# EAGLE design Sine 5KW co sac copy (EAGLE 9.6.2)
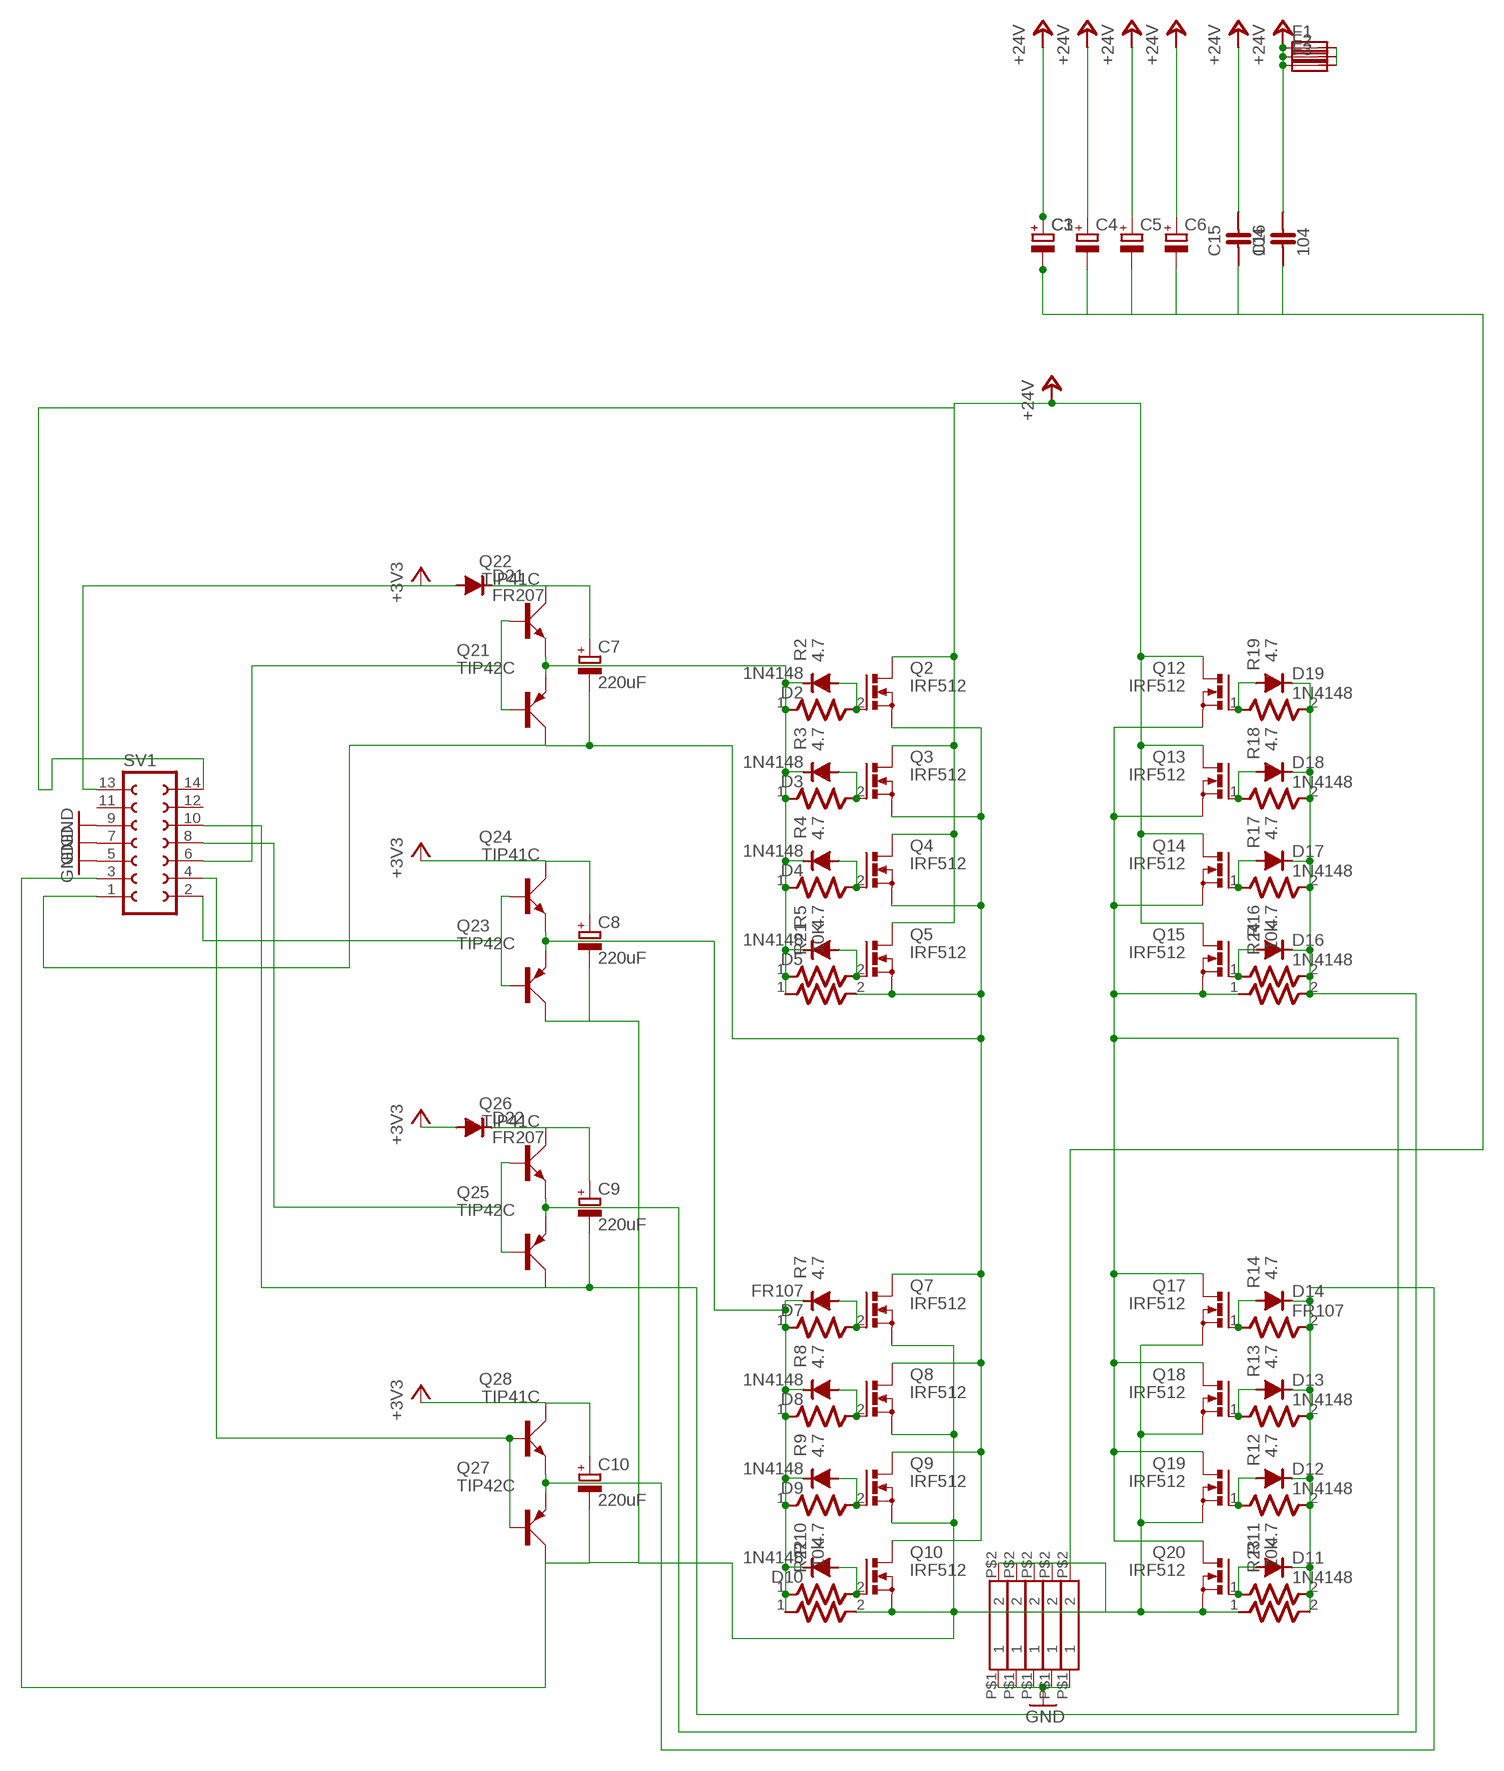
[diagram p0: schematic, sheet 1]

## Parts
C1  CPOL-EUE7.5-18  [E7,5-18]
C3  CPOL-EUE7.5-18  [E7,5-18]
C4  CPOL-EUE7.5-18  [E7,5-18]
C5  CPOL-EUE7.5-18  [E7,5-18]
C6  CPOL-EUE7.5-18  [E7,5-18]
C7  220uF  CPOL-EUE5-8.5  [E5-8,5]
C8  220uF  CPOL-EUE5-8.5  [E5-8,5]
C9  220uF  CPOL-EUE5-8.5  [E5-8,5]
C10  220uF  CPOL-EUE5-8.5  [E5-8,5]
C15  104  CAP-NP5  [CAP-NP5]
C16  104  CAP-NP5  [CAP-NP5]
D2  1N4148  [D-7,5]
D3  1N4148  [D-7,5]
D4  1N4148  [D-7,5]
D5  1N4148  [D-7,5]
D7  FR107  1N4148  [D-7,5]
D8  1N4148  [D-7,5]
D9  1N4148  [D-7,5]
D10  1N4148  [D-7,5]
D11  1N4148  [D-7,5]
D12  1N4148  [D-7,5]
D13  1N4148  [D-7,5]
D14  FR107  1N4148  [D-7,5]
D16  1N4148  [D-7,5]
D17  1N4148  [D-7,5]
D18  1N4148  [D-7,5]
D19  1N4148  [D-7,5]
D21  FR207  1N4148  [D-7,5]
D22  FR207  1N4148  [D-7,5]
F1  LITTLEFUSE  [LITTLEFUSE]
F2  LITTLEFUSE  [LITTLEFUSE]
F3  LITTLEFUSE  [LITTLEFUSE]
Q2  IRF512  [TO220BV]
Q3  IRF512  [TO220BV]
Q4  IRF512  [TO220BV]
Q5  IRF512  [TO220BV]
Q7  IRF512  [TO220BV]
Q8  IRF512  [TO220BV]
Q9  IRF512  [TO220BV]
Q10  IRF512  [TO220BV]
Q12  IRF512  [TO220BV]
Q13  IRF512  [TO220BV]
Q14  IRF512  [TO220BV]
Q15  IRF512  [TO220BV]
Q17  IRF512  [TO220BV]
Q18  IRF512  [TO220BV]
Q19  IRF512  [TO220BV]
Q20  IRF512  [TO220BV]
Q21  TIP42C  [TO220AV]
Q22  TIP41C  [TO220AV]
Q23  TIP42C  [TO220AV]
Q24  TIP41C  [TO220AV]
Q25  TIP42C  [TO220AV]
Q26  TIP41C  [TO220AV]
Q27  TIP42C  [TO220AV]
Q28  TIP41C  [TO220AV]
R2  4.7  R-7,5  [R-7,5]
R3  4.7  R-7,5  [R-7,5]
R4  4.7  R-7,5  [R-7,5]
R5  4.7  R-7,5  [R-7,5]
R7  4.7  R-7,5  [R-7,5]
R8  4.7  R-7,5  [R-7,5]
R9  4.7  R-7,5  [R-7,5]
R10  4.7  R-7,5  [R-7,5]
R11  4.7  R-7,5  [R-7,5]
R12  4.7  R-7,5  [R-7,5]
R13  4.7  R-7,5  [R-7,5]
R14  4.7  R-7,5  [R-7,5]
R16  4.7  R-7,5  [R-7,5]
R17  4.7  R-7,5  [R-7,5]
R18  4.7  R-7,5  [R-7,5]
R19  4.7  R-7,5  [R-7,5]
R21  10K  R-7,5  [R-7,5]
R22  10k  R-7,5  [R-7,5]
R23  10k  R-7,5  [R-7,5]
R24  10k  R-7,5  [R-7,5]
SV1  FE07-2  [FE07-2]
U$2  SHUNT  [SHUNT]
U$3  SHUNT  [SHUNT]
U$8  SHUNT  [SHUNT]
U$9  SHUNT  [SHUNT]
U$10  SHUNT  [SHUNT]

## Nets
+3V3: C8.+ C10.+ D21.A D22.A Q24.C Q28.C SV1.13
GND: SV1.5 SV1.7 SV1.9 U$2.P$1 U$3.P$1 U$8.P$1 U$9.P$1 U$10.P$1
N$1: Q23.B Q24.B SV1.2
N$2: C9.+ D22.C Q26.C
N$3: Q21.B Q22.B SV1.6
N$4: D7.C D8.C D9.C D10.C Q23.E Q24.E R7.1 R8.1 R9.1 R10.1 R22.1
N$5: D13.A Q18.G R13.1
N$6: Q27.B Q28.B SV1.4
N$7: D2.A Q2.G R2.2
N$8: D3.A Q3.G R3.2
N$9: D4.A Q4.G R4.2
N$10: D5.A Q5.G R5.2
N$11: F1.2 F2.2 F3.2
N$12: D7.A Q7.G R7.2
N$13: D8.A Q8.G R8.2
N$14: D9.A Q9.G R9.2
N$15: D10.A Q10.G R10.2
N$16: D11.A Q20.G R11.1
N$17: D12.A Q19.G R12.1
N$18: C9.- Q12.S Q13.S Q14.S Q15.S Q17.D Q18.D Q19.D Q20.D Q25.C R24.1 SV1.10
N$19: D16.A Q15.G R16.1
N$20: D17.A Q14.G R17.1
N$21: D18.A Q13.G R18.1
N$22: D19.A Q12.G R19.1
N$23: Q25.B Q26.B SV1.8
N$24: D14.A Q17.G R14.1
N$25: C1.- C3.- C4.- C5.- C6.- C8.- C10.- C15.1 C16.1 Q7.S Q8.S Q9.S Q10.S Q17.S Q18.S Q19.S Q20.S Q23.C Q27.C R22.2 R23.1 SV1.3 U$2.P$2 U$3.P$2 U$8.P$2 U$9.P$2 U$10.P$2
N$28: D11.C D12.C D13.C D14.C Q27.E Q28.E R11.2 R12.2 R13.2 R14.2 R23.2
N$29: D16.C D17.C D18.C D19.C Q25.E Q26.E R16.2 R17.2 R18.2 R19.2 R24.2
N$35: C7.- Q2.S Q3.S Q4.S Q5.S Q7.D Q8.D Q9.D Q10.D Q21.C R21.2 SV1.1
N$36: C7.+ D21.C Q22.C
N$68: D2.C D3.C D4.C D5.C Q21.E Q22.E R2.1 R3.1 R4.1 R5.1 R21.1
VCC: C1.+ C3.+ C4.+ C5.+ C6.+ C15.2 C16.2 F1.1 F2.1 F3.1 Q2.D Q3.D Q4.D Q5.D Q12.D Q13.D Q14.D Q15.D SV1.14 ; supply symbol labelled +24V
Unconnected: SV1.11 SV1.12

## Library data of the parts
C1 C3-C10 = LBR inverter true sine:CPOL-EU: POLARIZED CAPACITOR, European symbol
C15 C16 = lbr:CAP-NP5
D2-D5 D7-D14 D16-D19 D21 D22 = 4148:1N4148
F1-F3 = LBR inverter true sine:LITTLEFUSE: LITTLEFUSE Picofuse/slow Littlefuse; OC_FARNELL: unknown; OC_NEWARK: unknown
Q2-Q5 Q7-Q10 Q12 Q13 Q15 Q17-Q20 = transistor-power:IRF512: N-CHANNEL MOS FET
Q14 = transistor-power:IRF512: N-CHANNEL MOS FET; SPICEPREFIX: M
Q21 = transistor-power:TIP42C: PNP TRANSISTOR; SPICEPREFIX: Q
Q22 Q24 Q26 Q28 = transistor-power:TIP41C: NPN TRANSISTOR
Q23 Q25 Q27 = transistor-power:TIP42C: PNP TRANSISTOR
R2-R5 R7-R14 R16-R19 R21-R24 = chuong:R-7,5
SV1 = con-lsta:FE07-2: FEMALE HEADER; OC_FARNELL: unknown; OC_NEWARK: unknown; SPICEPREFIX: X
U$2 U$3 U$8-U$10 = LBR inverter true sine:SHUNT

## Board
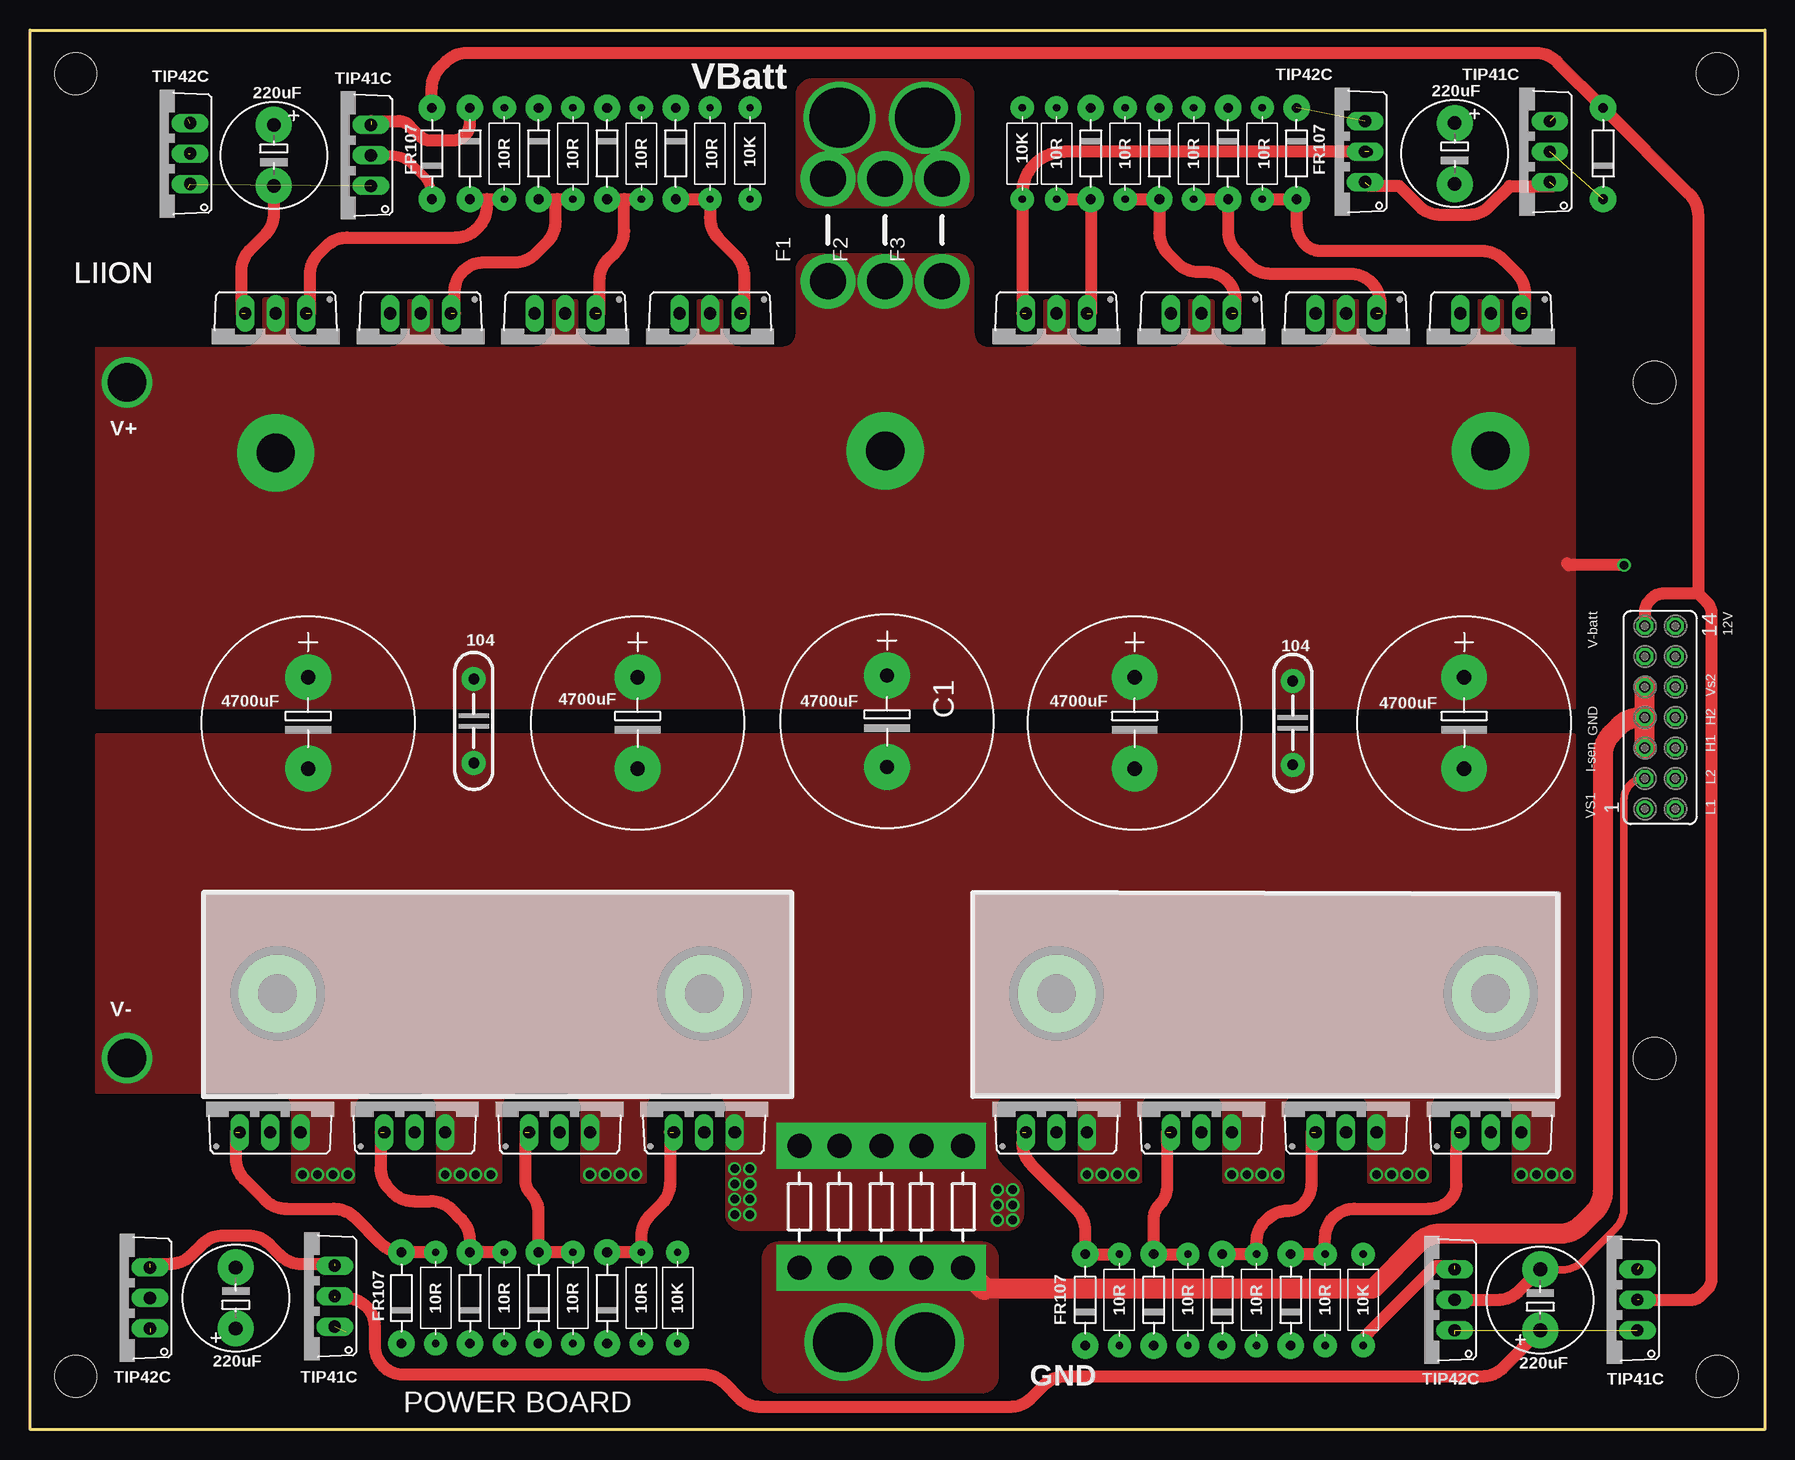
[diagram p1: board, top side]
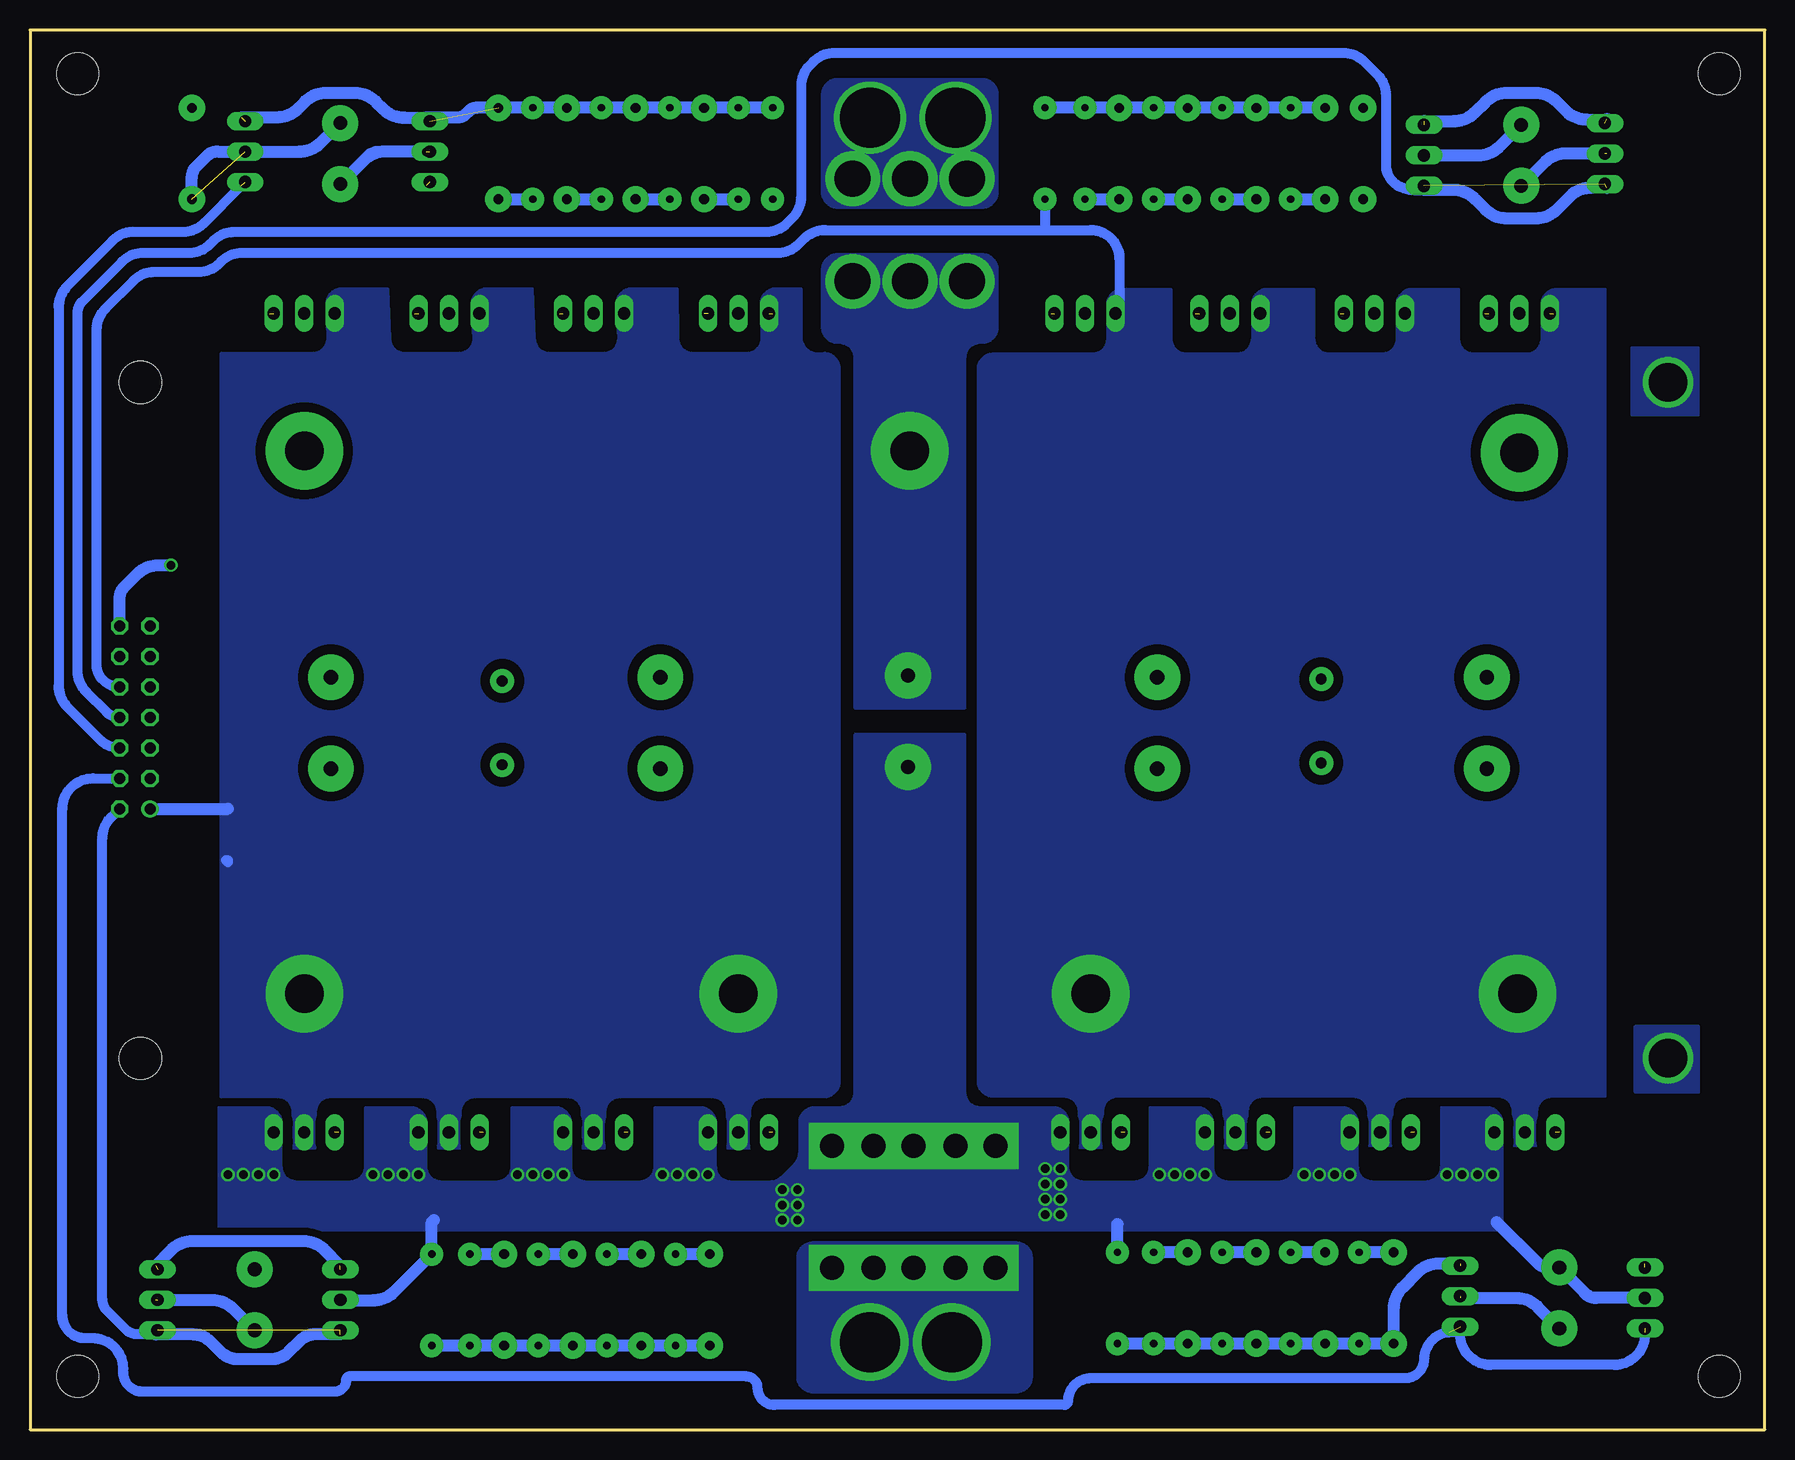
[diagram p2: board, bottom side, seen from below]

Size 144.62 x 116.68 mm. Coordinates in mm from the lower left corner, seen from the top.
Outline: 0,116.68 144.62,116.68 144.62,0 0,0 0,116.68
Copper layers (1*16): Top 0.035mm / dielectric 1.5mm / Bottom 0.035mm
Design rules "default": minimum track width 10mil, minimum drill 24mil, track to track 8mil, track to pad 8mil, pad to pad 8mil, via to via 8mil, smd to smd 8mil, copper to edge 40mil, drill to drill 8mil, minimum pad ring 10mil, minimum via ring 8mil, stop-mask expansion 4mil, vias tented up to drill 0mil, thermal gap 10mil
Holes 3.5 mm at 135.41,87.31 135.41,30.96 3.81,4.45 140.65,4.45 140.65,113.03 3.81,113.03

### Footprints (pad centres in the part's own frame; a part is rotated, then mirrored left to right if it is on the bottom)
E7,5-18 = drill 1.2 pad 3.81: + -3.81,0; - 3.81,0
E5-8,5 = drill 1.15 pad 3: + -2.54,0; - 2.54,0
CAP-NP5 = drill 0.9 pad 2: 1 -3.175,0; 2 3.81,0
D-7,5 = drill 0.8 pad 2.2: A 3.81,0; C -3.81,0
LITTLEFUSE = drill 3 pad 4.572: 1 -5.08,0; 2 3.493,0
TO220BV = drill 1.016 long: D 0,-2.54; G -2.54,-2.54; S 2.54,-2.54
TO220AV = drill 1.016 long: B -2.54,-2.54; C 0,-2.54; E 2.54,-2.54
R-7,5 = drill 0.61 pad 1.93: 1 -3.81,0; 2 3.81,0
FE07-2 = drill 0.914: 1 -7.62,1.27 | drill 0.914 octagon: 2 -7.62,-1.27; 3 -5.08,1.27; 4 -5.08,-1.27; 5 -2.54,1.27; 6 -2.54,-1.27; 7 0,1.27; 8 0,-1.27; 9 2.54,1.27; 10 2.54,-1.27; 11 5.08,1.27; 12 5.08,-1.27; 13 7.62,1.27; 14 7.62,-1.27
SHUNT = drill 2 pad 3.81 square: P$1 -5.08,0; P$2 5.08,0

### Placement (x,y rotation side)
C1  71.44,59.05 270 top
C3  23.18,58.92 270 top
C4  50.65,58.92 270 top
C5  92.08,58.92 270 top
C6  119.55,58.92 270 top
C7  118.75,106.39 270 top
C8  17.15,10.98 90 top
C9  20.33,106.23 270 top
C10  125.9,10.82 90 top
C15  37,58.76 90 top
C16  105.26,58.6 90 top
D2  88.43,106.39 270 top
D3  94.15,106.39 270 top
D4  99.86,106.39 270 top
D5  105.58,106.39 270 top
D7  87.95,10.82 90 top
D8  93.67,10.82 90 top
D9  99.38,10.82 90 top
D10  105.1,10.82 90 top
D11  48.11,10.98 90 top
D12  42.39,10.98 90 top
D13  36.68,10.98 90 top
D14  30.96,10.98 90 top
D16  53.82,106.39 270 top
D17  48.11,106.39 270 top
D18  42.39,106.39 270 top
D19  36.68,106.39 270 top
D21  131.13,106.39 90 top
D22  33.5,106.39 90 top
F1  66.52,100.81 90 top
F2  71.28,100.81 90 top
F3  76.04,100.81 90 top
Q2  85.57,90.51 180 top
Q3  97.64,90.51 180 top
Q4  109.7,90.51 180 top
Q5  121.77,90.51 180 top
Q7  85.57,27.33 0 top
Q8  97.64,27.33 0 top
Q9  109.7,27.33 0 top
Q10  121.77,27.33 0 top
Q12  20.49,90.51 180 top
Q13  32.55,90.51 180 top
Q14  44.62,90.51 180 top
Q15  56.68,90.51 180 top
Q17  20.01,27.33 0 top
Q18  32.07,27.33 0 top
Q19  44.14,27.33 0 top
Q20  56.2,27.33 0 top
Q21  108.75,106.55 90 top
Q22  124.15,106.55 90 top
Q23  116.21,10.82 90 top
Q24  131.45,10.82 90 top
Q25  10.8,106.39 90 top
Q26  25.88,106.23 90 top
Q27  7.47,10.98 90 top
Q28  22.87,11.14 90 top
R2  85.57,106.39 270 top
R3  91.29,106.39 270 top
R4  97,106.39 270 top
R5  102.72,106.39 270 top
R7  90.81,10.82 90 top
R8  96.53,10.82 90 top
R9  102.24,10.82 90 top
R10  107.96,10.82 90 top
R11  50.97,10.98 270 top
R12  45.25,10.98 270 top
R13  39.54,10.98 270 top
R14  33.82,10.98 270 top
R16  56.68,106.39 90 top
R17  50.97,106.39 90 top
R18  45.25,106.39 90 top
R19  39.54,106.39 90 top
R21  82.72,106.39 270 top
R22  111.13,10.82 90 top
R23  53.98,10.98 270 top
R24  60.01,106.39 90 top
SV1  135.89,59.37 90 top
U$2  64.13,18.57 90 top
U$3  67.47,18.57 90 top
U$8  70.96,18.57 90 top
U$9  74.3,18.57 90 top
U$10  77.79,18.57 90 top

### Tracks (layer width: path | path; a pad name or v marks a point on that pad's centre or on a via)
+3V3  (4 unrouted)
  Top 0.254: 52.07,4.6 51.99,4.6
  Top 1.016: 25.41,10.98 26.33,10.98 arc-90 28.73,8.57 28.73,6.98 arc90 31.11,4.6 51.99,4.6 | C10.+ 122.79,5.18 arc-45 121.02,4.44 86.28,4.44 arc45 84.52,3.71 83.44,2.64 arc-45 81.67,1.9 60.88,1.9 arc-45 59.12,2.64 57.88,3.87 arc45 56.11,4.6 52.07,4.6 | D22.A 33.5,111.84 arc-45 34.23,113.6 34.67,114.04 arc-45 36.44,114.78 125.52,114.78 arc-45 127.29,114.04 D21.A | D21.A 131.1,110.2 | D21.A 138.33,103 arc-45 139.06,101.23 139.06,69.69 | 134.15,10.82 138.41,10.82 arc45 139.3,11.19 139.8,11.69 arc45 140.18,12.59 140.18,68.05 arc45 139.8,68.95 139.06,69.69 | 139.06,69.69 136.1,69.69 arc45 135.2,69.32 134.99,69.11 arc45 134.62,68.21 SV1.13
  Bottom 1.016: 25.41,10.98 20.73,10.98 arc45 18.96,10.25 C8.+ | 134.15,10.82 129.47,10.82 arc45 127.7,10.09 C10.+
GND  (via drill 5 pad 6.45)
  Top 1.676: 79.53,11.75 111.92,11.75 115.79,15.62 arc-45 117.56,16.35 127.55,16.35 arc45 129.32,17.08 130.4,18.16 arc45 131.13,19.93 131.13,56.27 arc-45 131.86,58.04 132.46,58.64 arc-45 134.23,59.37 | SV1.9 SV1.7 SV1.5
  Top 1.93: 79.53,11.75 U$10.P$1 | SV1.7 134.23,59.37
  Bottom 1.93: U$10.P$1 arc-45 78.33,13.27
  other vias: 67.79,7.3 74.61,7.3
  pour Bottom (isolate 0.406, no thermals): 61.12,4.45 61.12,14.29 arc-90 62.39,15.56 79.38,15.56 arc-90 80.64,14.29 80.64,4.45 arc-90 79.38,3.17 62.39,3.17 arc-90
  pour Top (isolate 0.406, no thermals): 80.64,4.45 80.64,14.29 arc90 79.38,15.56 62.39,15.56 arc90 61.12,14.29 61.12,4.45 arc90 62.39,3.17 79.38,3.17 arc90
N$1  (2 unrouted)
  Bottom 0.813: SV1.2 137.86,51.06 arc-45 138.59,49.29 138.59,10.84 arc-45 138.22,9.95 136.61,8.33 arc-45 135.71,7.96 134.15,7.96
  Bottom 1.016: 118.75,7.96 120.75,7.96 arc-45 122.16,7.38 123.08,6.46 arc45 124.49,5.87 127.28,5.87 arc45 128.7,6.46 129.59,7.35 arc-45 131,7.94 134.12,7.94 134.15,7.96
N$2
  Top 0.813: Q26.C 30.05,106.23 arc-45 31.82,105.5 32.77,104.55 arc-45 33.5,102.78 D22.C
  Bottom 1.016: Q26.C 23.9,106.23 arc-45 22.13,106.96 C9.+
N$3  (3 unrouted)
  Top 1.016: 111.61,103.69 114.12,103.69 115.79,102.01 arc45 117.56,101.28 119.93,101.28 arc45 121.7,102.01 123.35,103.66 126.98,103.66 127.01,103.69
  Bottom 0.813: SV1.6 arc45 138.79,57.51 141.51,60.23 arc45 142.24,62 142.24,93.58 arc45 141.51,95.35 137.73,99.12 arc45 135.97,99.85 131.88,99.85 arc-45 130.11,100.59 127.01,103.69
N$4  (3 unrouted)
  Top 1.016: R22.1 arc-45 111.57,8.06 117.16,13.65 118.73,13.65 118.75,13.68
  Bottom 1.016: D7.C R7.1 D8.C R8.1 D9.C R9.1 D10.C R10.1 R22.1 | 118.75,13.68 118.77,13.68 120.08,14.98 arc-45 121.84,15.72 131.08,15.72 arc-45 132.84,14.98 134.15,13.68
N$5  (1 unrouted)
  Top 1.016: R13.1 36.7,14.79 36.67,14.76 | 29.22,24.79 29.22,21.83 arc45 29.95,20.06 30.22,19.78 arc45 31.99,19.05 33.41,19.05 arc-45 35.18,18.32 35.95,17.55 arc-45 36.68,15.79 D13.A
  Bottom 1.016: D13.A R13.1
N$6  (2 unrouted)
  Bottom 0.813: 10.01,8.12 10.01,7.94 arc90 12.55,5.4 22.87,5.4 arc90 25.41,7.94 25.41,8.12 26.17,8.12 | 26.17,8.12 26.35,8.12 | SV1.4 139.38,54.29 arc-90 141.92,51.75 141.92,9.52 arc-90 140.02,7.62 139.38,7.62 arc90 136.84,5.08 136.84,4.76 arc-90 135.25,3.17 119.22,3.17 arc-90 118.27,4.13 arc90 117.95,4.44 84.93,4.44 arc90 83.98,3.49 arc-90 82.55,2.06 58.42,2.06 arc-90 58.1,2.38 arc90 56.2,4.29 30,4.29 arc-90 28.42,5.87 arc90 26.17,8.12
N$7  (1 unrouted)
  Top 1.016: 88.43,93.05 D2.A R2.2
N$8  (1 unrouted)
  Top 1.016: 100.49,93.05 100.49,93.06 100.49,94.11 arc45 99.79,95.79 arc45 98.02,96.52 97.4,96.52 arc-45 95.63,97.25 94.88,98 arc-45 94.14,99.77 D3.A R3.2
N$9  (1 unrouted)
  Top 1.016: 112.56,93.05 112.55,93.06 112.55,93.86 arc90 110.05,96.36 103.43,96.36 arc-45 101.66,97.09 100.59,98.16 arc-45 99.86,99.93 D4.A R4.2
N$10  (1 unrouted)
  Top 1.016: 124.62,93.05 124.62,93.06 124.62,94.69 arc45 123.89,96.46 122.81,97.53 arc45 121.04,98.27 107.59,98.27 arc-45 106.31,98.8 arc-45 105.57,100.57 D5.A R5.2
N$11  (via drill 5)
  other vias: 67.47,109.38 74.61,109.38
  pour Top (no thermals): 78.58,111.28 78.58,103.19 arc-90 77.31,101.92 65.25,101.92 arc-90 63.98,103.19 63.98,111.28 arc-90 65.25,112.55 77.31,112.55 arc-90
  pour Bottom (no thermals): 77.31,101.92 65.25,101.92 arc-90 63.98,103.19 63.98,111.28 arc-90 65.25,112.55 77.31,112.55 arc-90 78.58,111.28 78.58,103.19 arc-90
N$12  (1 unrouted)
  Top 1.016: 90.8,14.6 90.78,14.63 D7.A 87.95,16.59 arc45 87.21,18.35 83.45,22.12 arc-45 82.71,23.89 82.71,24.79
  Bottom 1.016: D7.A R7.2
N$13  (1 unrouted)
  Top 1.016: 96.52,14.6 96.49,14.63 D8.A 93.67,17.6 arc-45 94.14,18.73 arc45 94.78,20.28 94.78,24.79
  Bottom 1.016: D8.A R8.2
N$14  (1 unrouted)
  Top 1.016: 99.38,14.6 99.4,14.63 R9.2 102.24,15.64 arc-45 102.97,17.41 103.09,17.52 arc-45 104.86,18.26 arc45 106.07,18.76 106.11,18.79 arc45 106.84,20.56 106.84,24.78 106.84,24.79
  Bottom 1.016: D9.A R9.2
N$15  (1 unrouted)
  Top 1.016: 105.09,14.6 105.12,14.63 R10.2 107.96,15.96 arc-45 108.69,17.72 arc-45 110.35,18.41 116.6,18.41 arc45 118.37,19.15 arc45 118.9,20.45 118.9,23.42 118.91,23.43 118.91,24.79
  Bottom 1.016: D10.A R10.2
N$16  (1 unrouted)
  Top 1.016: 48.1,14.76 48.13,14.79 R11.1 50.97,16.12 arc-45 51.7,17.88 52.61,18.8 arc45 53.35,20.57 53.35,24.79
  Bottom 1.016: D11.A R11.1
N$17  (1 unrouted)
  Top 1.016: R12.1 42.41,14.79 42.39,14.76 | 41.28,24.79 41.28,20.82 arc45 41.75,19.68 arc-45 42.39,18.14 D12.A
  Bottom 1.016: D12.A R12.1
N$18  (via drill 3.2 pad 6.45)  (2 unrouted)
  Top 1.016: C9.- 20.33,101.37 arc-45 19.59,99.6 18.36,98.37 arc45 17.63,96.6 17.63,93.05
  Bottom 0.813: SV1.10 arc45 138.52,62.47 138.59,62.55 arc45 139.06,63.7 139.06,91.67 arc45 138.33,93.44 135.99,95.79 arc45 134.22,96.52 130.58,96.52 arc-45 128.81,97.25 128.69,97.38 arc45 126.92,98.11 82.32,98.11 arc-45 80.55,98.84 80.11,99.28 arc45 78.34,100.01 60.01,100.01 | 60.01,100.01 56.2,100.01 arc90 53.82,97.63 53.82,93.06 arc90 53.82,93.05 | 60.01,102.56 R24.1 60.01,100.02 arc-90 60.01,100.01
  Bottom 1.016: 13.18,106.39 16.59,106.39 arc-45 18.36,105.66 C9.-
  other vias: 20.64,36.35 56.2,36.35
  pour Bottom (isolate 0.813, no thermals): 18.57,90.96 18.57,93.82 arc90 17.3,95.09 13.34,95.09 13.34,27.78 17.78,27.78 arc-90 19.05,26.51 19.05,23.65 20.95,23.65 20.95,26.51 arc-90 22.22,27.78 29.84,27.78 arc-90 31.11,26.51 31.11,23.65 33.02,23.65 33.02,26.51 arc-90 34.29,27.78 41.91,27.78 arc-90 43.18,26.51 43.18,23.5 45.09,23.5 45.09,26.51 arc-90 46.36,27.78 53.98,27.78 arc-90 55.25,26.51 55.25,23.5 57.15,23.5 57.15,26.51 arc-90 58.42,27.78 64.29,27.78 arc90 65.56,29.05 65.56,88.42 arc90 64.29,89.69 56.04,89.69 arc-90 54.77,90.96 54.77,93.82 arc90 53.5,95.09 49.53,95.09 49.53,90.96 arc-90 48.26,89.69 43.97,89.69 arc-90 42.7,90.96 42.7,93.82 arc90 41.43,95.09 37.62,95.09 37.62,90.96 arc-90 36.35,89.69 31.91,89.69 arc-90 30.64,90.96 30.64,93.82 arc90 29.37,95.09 25.56,95.09 25.56,90.96 arc-90 24.29,89.69 19.84,89.69 arc-90
N$19  (1 unrouted)
  Top 1.016: D16.A R16.1 56.68,101.04 arc45 57.41,99.27 58.8,97.89 arc-45 59.53,96.12 59.53,93.06 59.54,93.05
N$20  (1 unrouted)
  Top 1.016: D17.A 49.53,102.58 | 49.53,102.58 R17.1 | 47.47,93.05 47.47,95.81 arc-45 48.21,97.58 48.8,98.17 arc45 49.53,99.94 49.53,102.58
N$21  (1 unrouted)
  Top 1.016: D18.A 43.97,102.58 | 43.97,102.58 R18.1 | 35.41,93.05 35.41,94.92 arc-45 36.1,96.58 arc-45 37.87,97.31 40.4,97.31 arc45 42.17,98.05 43.08,98.96 arc45 43.82,100.73 43.82,102.42 43.97,102.58
N$22  (1 unrouted)
  Top 1.016: D19.A 38.1,102.58 | 38.1,102.58 R19.1 | 23.34,93.05 23.34,96.28 arc-45 24.07,98.05 24.67,98.65 arc-45 26.44,99.38 35.48,99.38 arc45 37.25,100.11 37.37,100.23 arc45 38.1,102 38.1,102.58
N$23  (2 unrouted)
  Bottom 0.813: SV1.8 arc45 138.24,59.82 139.92,61.5 arc45 140.65,63.27 140.65,93.14 arc45 140.28,94.03 136.94,97.38 arc45 135.17,98.11 131.37,98.11 arc-45 129.6,98.84 129.32,99.12 arc45 127.55,99.85 83.27,99.85 arc-45 81.5,100.59 81.06,101.03 arc-45 80.33,102.79 80.33,111.99 arc45 79.59,113.76 79.31,114.04 arc45 77.55,114.78 35.17,114.78 arc45 33.4,114.04 32.32,112.97 arc45 31.59,111.2 31.59,105.38 arc-45 31.05,104.08 arc-45 29.29,103.35 28.45,103.35 28.42,103.37
  Bottom 1.016: 13.18,103.53 14.5,103.53 arc-45 16.26,102.8 17.36,101.7 arc45 19.13,100.96 21.51,100.96 arc45 23.27,101.7 24.19,102.61 arc-45 25.96,103.35 28.4,103.35 28.42,103.37
N$24  (1 unrouted)
  Top 1.016: R14.1 30.98,14.79 30.96,14.76 | 17.15,24.79 17.15,22.62 arc45 17.88,20.85 19.59,19.15 arc45 21.36,18.41 25.32,18.41 arc-45 27.08,17.68 29.28,15.48 arc45 D14.A
  Bottom 1.016: D14.A R14.1
N$25  (via drill 0.7, 3.2)
  Top 0.61: SV1.3 arc90 132.87,52.55 132.87,18.5 arc-45 132.14,16.73 129.48,14.07 arc-45 127.71,13.33 125.92,13.33 C10.-
  Top 1.016: Q23.C 122.32,10.82 arc45 124.09,11.55 C10.- 124.06,11.53 arc-45 122.29,10.79 v118.74,10.79
  Bottom 1.016: Q27.C 14.09,10.98 arc45 14.98,11.35 C8.- 18.07,13.52 arc45 18.97,13.89 22.38,17.3 | R23.1 53.98,17.14 | 110.97,17.46 111.13,17.3 R22.2 114.23,11.53 arc45 116,10.79 v118.74,10.79
  other vias: 22.7,21.27 23.97,21.27 25.24,21.27 26.51,21.27 34.61,21.27 35.88,21.27 37.15,21.27 38.42,21.27 46.67,21.27 47.94,21.27 49.21,21.27 50.48,21.27 88.11,21.27 89.38,21.27 90.65,21.27 91.92,21.27 100.17,21.27 101.44,21.27 102.71,21.27 103.98,21.27 112.24,21.27 113.51,21.27 114.78,21.27 116.05,21.27 124.3,21.27 125.57,21.27 126.84,21.27 128.11,21.27 81.91,20 81.91,18.73 81.91,17.46 80.64,20 80.64,18.73 80.64,17.46 58.74,21.75 58.74,20.48 58.74,19.21 58.74,17.94 60.01,21.75 60.01,20.48 60.01,19.21 60.01,17.94 8.1,30.96
  pour Top (isolate 0.686, no thermals): 21.91,20.64 21.91,26.83 arc90 20.64,28.1 5.56,28.1 5.56,57.94 128.75,57.94 128.75,20.64 123.67,20.64 123.67,26.83 arc90 122.4,28.1 117.95,28.1 arc90 116.68,26.83 116.68,20.64 111.6,20.64 111.6,26.83 arc90 110.33,28.1 105.73,28.1 arc90 104.46,26.83 104.46,20.64 99.54,20.64 99.54,26.83 arc90 98.27,28.1 93.82,28.1 arc90 92.55,26.83 92.55,20.64 87.47,20.64 87.47,26.83 arc90 86.2,28.1 81.76,28.1 arc90 80.49,26.83 80.49,23.07 arc45 80.86,22.17 82.34,20.69 arc-45 82.71,19.79 82.71,17.94 arc-90 81.44,16.67 59.37,16.67 arc-90 58.1,17.94 58.1,26.83 arc90 56.83,28.1 52.55,28.1 arc90 51.28,26.83 51.28,20.64 46.04,20.64 46.04,26.83 arc90 44.77,28.1 40.48,28.1 arc90 39.21,26.83 39.21,20.64 33.97,20.64 33.97,26.83 arc90 32.7,28.1 28.26,28.1 arc90 26.99,26.83 26.99,20.64
  pour Bottom (no thermals): 5.56,33.66 5.56,28.1 10.79,28.1 10.79,33.66
  pour Bottom (isolate 0.61, no thermals): 128.91,16.67 21.91,16.67 21.91,25.56 arc-90 23.18,26.83 26.99,26.83 26.99,21.91 arc90 28.26,20.64 32.7,20.64 arc90 33.97,21.91 33.97,25.56 arc-90 35.24,26.83 39.21,26.83 39.21,21.91 arc90 40.48,20.64 44.77,20.64 arc90 46.04,21.91 46.04,25.56 arc-90 47.31,26.83 51.28,26.83 51.28,21.91 arc90 52.55,20.64 56.83,20.64 arc90 58.1,21.91 58.1,25.72 arc-90 59.37,26.83 65.41,26.83 arc90 66.67,28.1 66.67,57.94 75.88,57.94 75.88,28.1 arc90 77.15,26.83 79.22,26.83 arc-90 80.49,25.56 80.49,23.07 arc45 80.86,22.17 82.02,21.01 arc45 82.92,20.64 86.2,20.64 arc90 87.47,21.91 87.47,25.56 arc-90 88.74,26.83 92.55,26.83 92.55,21.91 arc90 93.82,20.64 98.27,20.64 arc90 99.54,21.91 99.54,25.56 arc-90 100.81,26.83 104.46,26.83 104.46,21.91 arc90 105.73,20.64 110.33,20.64 arc90 111.6,21.91 111.6,25.56 arc-90 112.87,26.83 116.68,26.83 116.68,21.91 arc90 117.95,20.64 122.4,20.64 arc90 123.67,21.91 123.67,25.56 arc-90 124.94,26.83 128.91,26.83
N$26
  Bottom 1.016: 36.67,102.55 39.53,102.55
N$27
  Bottom 1.016: 42.39,102.55 45.24,102.55
N$28  (3 unrouted)
  Top 1.016: 10.01,13.84 11.69,13.84 arc45 13.46,14.57 14.35,15.46 arc-45 16.12,16.19 18.17,16.19 arc-45 19.94,15.46 20.86,14.54 arc45 22.63,13.81 25.38,13.81 25.41,13.84
  Bottom 1.016: R23.2 R11.2 D11.C R12.2 D12.C R13.2 D13.C R14.2 D14.C 30.96,10.08 arc45 30.22,11.84 28.96,13.1 arc45 27.2,13.84 25.41,13.84
N$29  (3 unrouted)
  Top 1.016: 28.42,109.09 30.72,109.09 arc-45 31.62,108.71 32.49,107.85 arc45 33.39,107.47 35.24,107.47 arc90 36.67,108.9 D19.C arc-90 D19.C
  Bottom 1.016: D19.C R19.2 D18.C R18.2 D17.C R17.2 D16.C R16.2 R24.2 | 28.42,109.09 25.93,109.09 arc-45 24.17,109.82 23.27,110.71 arc45 21.51,111.44 19.13,111.44 arc45 17.36,110.71 16.61,109.95 arc-45 14.84,109.22 13.21,109.22 13.18,109.25
N$30
  Bottom 1.016: 48.1,102.55 50.96,102.55
N$31
  Bottom 1.016: 53.82,102.55 56.67,102.55
N$32
  Bottom 1.016: 85.57,102.55 88.42,102.55
N$33
  Bottom 1.016: 91.28,102.55 94.14,102.55
N$34
  Bottom 1.016: 97,102.55 99.85,102.55
N$35  (via drill 0.7, 3.2 pad 6.45)  (2 unrouted)
  Top 1.016: 82.71,93.05 R21.2 arc-90 R21.2 82.71,103.03 arc-90 86.2,106.52 v111.6,106.52
  Bottom 0.813: 128.27,47.47 128.11,47.31 128.11,47.47 | C7.- 116.44,106.16 arc45 115.57,106.52 v111.6,106.52
  Bottom 1.016: 111.61,106.55 115.02,106.55 arc-45 116.78,105.81 C7.- 116.45,106.15 arc45 115.55,106.52 | SV1.1 128.11,51.75
  other vias: 85.57,36.35 121.76,36.35
  pour Bottom (isolate 0.813, no thermals): 83.34,27.78 78.42,27.78 arc-90 77.15,29.05 77.15,88.42 arc-90 78.42,89.69 arc90 80.33,90.8 80.33,95.09 82.43,95.09 arc-88 83.7,93.86 83.62,90.92 arc88 84.89,89.69 89.34,89.69 arc92 90.61,91 90.65,95.09 94.46,95.09 arc-90 95.73,93.82 95.57,90.96 arc90 96.84,89.69 101.28,89.69 arc90 102.55,90.96 102.71,95.09 106.52,95.09 arc-90 107.79,93.82 107.63,90.96 arc90 108.9,89.69 113.35,89.69 arc90 114.62,90.96 114.78,95.09 118.63,95.09 arc-88 119.89,93.86 119.82,90.92 arc88 121.09,89.69 128.75,89.69 128.75,27.78 123.98,27.78 arc90 122.71,26.51 122.71,23.5 120.81,23.5 120.81,26.51 arc90 119.54,27.78 111.92,27.78 arc90 110.65,26.51 110.65,23.5 108.74,23.5 108.74,26.51 arc90 107.47,27.78 99.85,27.78 arc90 98.58,26.51 98.58,23.5 96.68,23.5 96.68,26.51 arc90 95.41,27.78 87.79,27.78 arc90 86.52,26.51 86.52,23.5 84.61,23.5 84.61,26.51 arc90
N$36  (1 unrouted)
  Bottom 1.016: C7.+ 120.4,107.28 arc45 122.17,106.55 128.99,106.55 arc-45 129.89,106.17 130.76,105.3 arc-45 131.13,104.4 D21.C
N$37
  Bottom 1.016: 102.71,102.55 105.57,102.55
N$68  (2 unrouted)
  Bottom 1.016: R21.1 R2.1 D2.C R3.1 D3.C R4.1 D4.C R5.1 D5.C 107.35,110.2 arc-45 108.06,109.9 108.29,109.67 arc45 109,109.38 111.58,109.38 111.61,109.4 111.63,109.38 113.42,109.38 arc45 115.19,110.11 115.79,110.71 arc-45 117.56,111.44 119.93,111.44 arc-45 121.7,110.71 122.27,110.14 arc45 124.04,109.4 127.01,109.4
VCC  (via drill 0.7, 3.2, 3.2 pad 6.45)
  Top 1.016: v132.87,72.07 128.27,72.07 128.11,72.23
  Bottom 1.016: SV1.14 137.16,69.32 arc45 136.79,70.22 135.67,71.34 arc45 133.9,72.07 v132.87,72.07
  other vias: 8.1,87.31 20.48,81.44 121.76,81.6 71.28,81.6
  pour Top (no thermals): 5.56,90.17 18,90.17 arc45 18.71,90.46 19.23,90.99 arc45 19.53,91.7 19.53,94.3 21.43,94.3 21.43,91.7 arc45 21.72,90.99 22.25,90.46 arc45 22.96,90.17 30.07,90.17 arc45 30.77,90.46 31.3,90.99 arc45 31.59,91.7 31.59,94.14 33.5,94.14 33.5,91.7 arc45 33.79,90.99 34.31,90.46 arc45 35.02,90.17 42.13,90.17 arc45 42.84,90.46 43.36,90.99 arc45 43.66,91.7 43.66,94.14 45.56,94.14 45.56,91.7 arc45 45.85,90.99 46.38,90.46 arc45 47.09,90.17 54.2,90.17 arc45 54.9,90.46 55.43,90.99 arc45 55.72,91.7 55.72,94.14 57.63,94.14 57.63,91.7 arc45 57.92,90.99 58.44,90.46 arc45 59.15,90.17 62.71,90.17 arc90 63.98,91.44 63.98,96.68 arc-90 65.25,97.95 77.31,97.95 arc-90 78.58,96.68 78.58,91.44 arc90 79.85,90.17 83.09,90.17 arc45 83.8,90.46 84.32,90.99 arc45 84.61,91.7 84.61,94.14 86.52,94.14 86.52,91.7 arc45 86.81,90.99 87.34,90.46 arc45 88.04,90.17 95.15,90.17 arc45 95.86,90.46 96.39,90.99 arc45 96.68,91.7 96.68,94.14 98.58,94.14 98.58,91.7 arc45 98.88,90.99 99.4,90.46 arc45 100.11,90.17 107.22,90.17 arc45 107.93,90.46 108.45,90.99 arc45 108.74,91.7 108.74,94.14 110.65,94.14 110.65,91.7 arc45 110.94,90.99 111.47,90.46 arc45 112.17,90.17 119.28,90.17 arc45 119.99,90.46 120.52,90.99 arc45 120.81,91.7 120.81,94.14 122.71,94.14 122.71,91.7 arc45 123.01,90.99 123.53,90.46 arc45 124.24,90.17 128.75,90.17 128.75,60.17 5.56,60.17
  pour Bottom (no thermals): 5.56,90.17 11.11,90.17 11.11,84.61 5.56,84.61
  pour Bottom (no thermals): 75.88,60.17 66.67,60.17 66.67,89.38 arc90 65.41,90.65 65.25,90.65 arc-90 63.98,91.92 63.98,96.68 arc-90 65.25,97.95 77.31,97.95 arc-90 78.58,96.68 78.58,91.92 arc-90 77.31,90.65 77.15,90.65 arc90 75.88,89.38

### Text on the board
tPlace: TIP42C | TIP41C | TIP42C | TIP41C | VBatt | 220uF | 220uF | 10R | 10R | 10R | 10R | 10K | 10K | 10R | 10R | 10R | 10R | FR107 | FR107 | LIION | LIION | LIION | LIION | LIION | LIION | V+ | V-batt | 104 | 104 | 12V | 4700uF | 4700uF | 4700uF | 4700uF | 4700uF | Vs2 | GND | H2 | I-sen | H1 | L2 | VS1 | L1 | V- | 10R | 10R | 10R | 10R | 10K | FR107 | FR107 | 10R | 10R | 10R | 10R | 10K | TIP42C | 220uF | TIP41C | TIP42C | 220uF | TIP41C | GND | POWER BOARD